# EAGLE design Hanover Flipdot Featherwing (EAGLE 9.6.2)
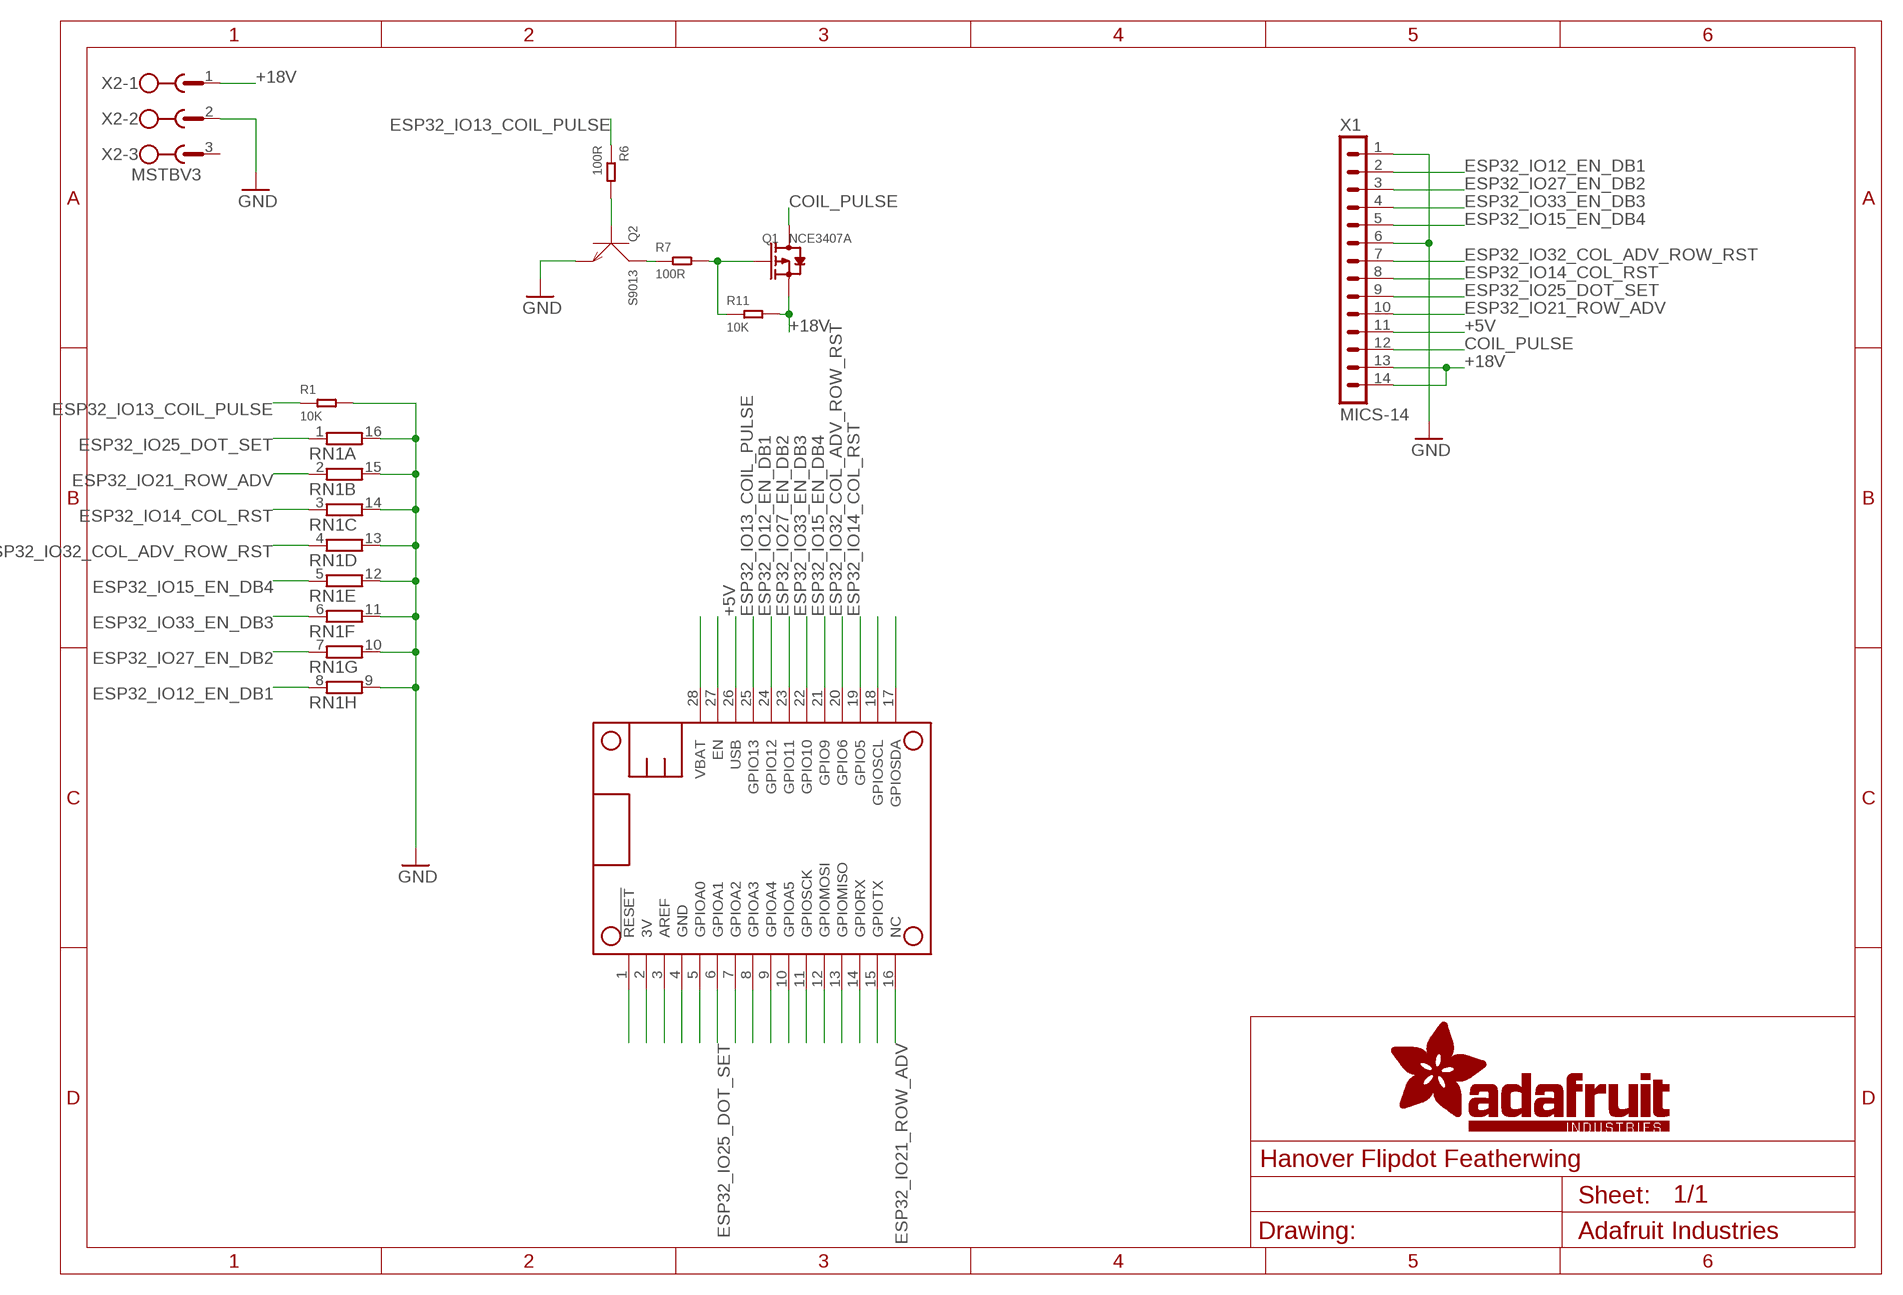
[diagram p0: schematic, sheet 1]

## Parts
MS1  FEATHERWING  [FEATHERWING]
Q1  NCE3407A  SMD-MOSFET-P-CH-VDC=30V-ID=4.3A-NCE3407A(SOT-23)  [SOT-23]
Q2  S9013  SMD-TRANSISTORS-NPN-25V-500MA-S9013(SOT-23)  [SOT-23]
R1  10K  SMD-RES-10K-1%-1/10W(0603)  [R0603]
R6  100R  SMD-RES-100R-5%-1/10W(0603)  [R0603]
R7  100R  SMD-RES-100R-5%-1/10W(0603)  [R0603]
R11  10K  SMD-RES-10K-1%-1/10W(0603)  [R0603]
RN1  8R-NEXB2HV  [EXB2HV]
X1  MICS-14  [MICS-14]
X2  MSTBV3  [MSTBV3]

## Nets
3V: MS1.2(3V)
+5V: MS1.26(USB) X1.11
+18V: Q1.2(S) R11.2 X1.13 X1.14 X2.1
AREF: MS1.3(AREF)
COIL_PULSE: Q1.3(D) X1.12
ESP32_IO12_EN_DB1: MS1.24(GPIO12) RN1.8 X1.2
ESP32_IO13_COIL_PULSE: MS1.25(GPIO13) R1.1 R6.1
ESP32_IO14_COL_RST: MS1.19(GPIO5) RN1.3 X1.8
ESP32_IO15_EN_DB4: MS1.21(GPIO9) RN1.5 X1.5
ESP32_IO21_ROW_ADV: MS1.16(NC) RN1.2 X1.10
ESP32_IO25_DOT_SET: MS1.6(GPIOA1) RN1.1 X1.9
ESP32_IO27_EN_DB2: MS1.23(GPIO11) RN1.7 X1.3
ESP32_IO32_COL_ADV_ROW_RST: MS1.20(GPIO6) RN1.4 X1.7
ESP32_IO33_EN_DB3: MS1.22(GPIO10) RN1.6 X1.4
GND: MS1.4(GND) Q2.2(E) R1.2 RN1.9 RN1.10 RN1.11 RN1.12 RN1.13 RN1.14 RN1.15 RN1.16 X1.1 X1.6 X2.2
N$1: MS1.27(EN)
N$3: Q2.1(B) R6.2
N$4: MS1.15(GPIOTX)
N$6: MS1.14(GPIORX)
N$7: MS1.13(GPIOMISO)
N$8: MS1.12(GPIOMOSI)
N$9: MS1.11(GPIOSCK)
N$10: MS1.10(GPIOA5)
N$11: MS1.9(GPIOA4)
N$12: MS1.8(GPIOA3)
N$13: MS1.7(GPIOA2)
N$15: MS1.5(GPIOA0)
N$16: Q1.1(G) R7.2 R11.1
N$17: Q2.3(C) R7.1
N$18: MS1.1(!RESET)
N$24: MS1.18(GPIOSCL)
N$25: MS1.17(GPIOSDA)
VBAT: MS1.28(VBAT)
Unconnected: X2.3

## Library data of the parts
MS1 = microbuilder:FEATHERWING
Q1 = OPL_Discrete_Semiconductor:SMD-MOSFET-P-CH-VDC=30V-ID=4.3A-NCE3407A(SOT-23): 305030010; MPN: NCE3407A
Q2 = OPL_Discrete_Semiconductor:SMD-TRANSISTORS-NPN-25V-500MA-S9013(SOT-23): 305010018; MPN: S9013
R1 R11 = OPL_Resistor:SMD-RES-10K-1%-1/10W(0603): 301011970; MPN: RC0603FR-0710KL
R6 R7 = OPL_Resistor:SMD-RES-100R-5%-1/10W(0603): 301011976; MPN: RC0603JR-07100RL
RN1 = resistor-dil:8R-N: DIL RESISTOR; OC_FARNELL: unknown; OC_NEWARK: unknown
X1 = con-lumberg:MICS-14: CONNECTOR; OC_FARNELL: unknown; OC_NEWARK: unknown
X2 = con-phoenix-508:MSTBV3: PHOENIX; MPN: MSTBV 2,5/3-GF-5.08; OC_FARNELL: 1792793; OC_NEWARK: 69R9846

## Board
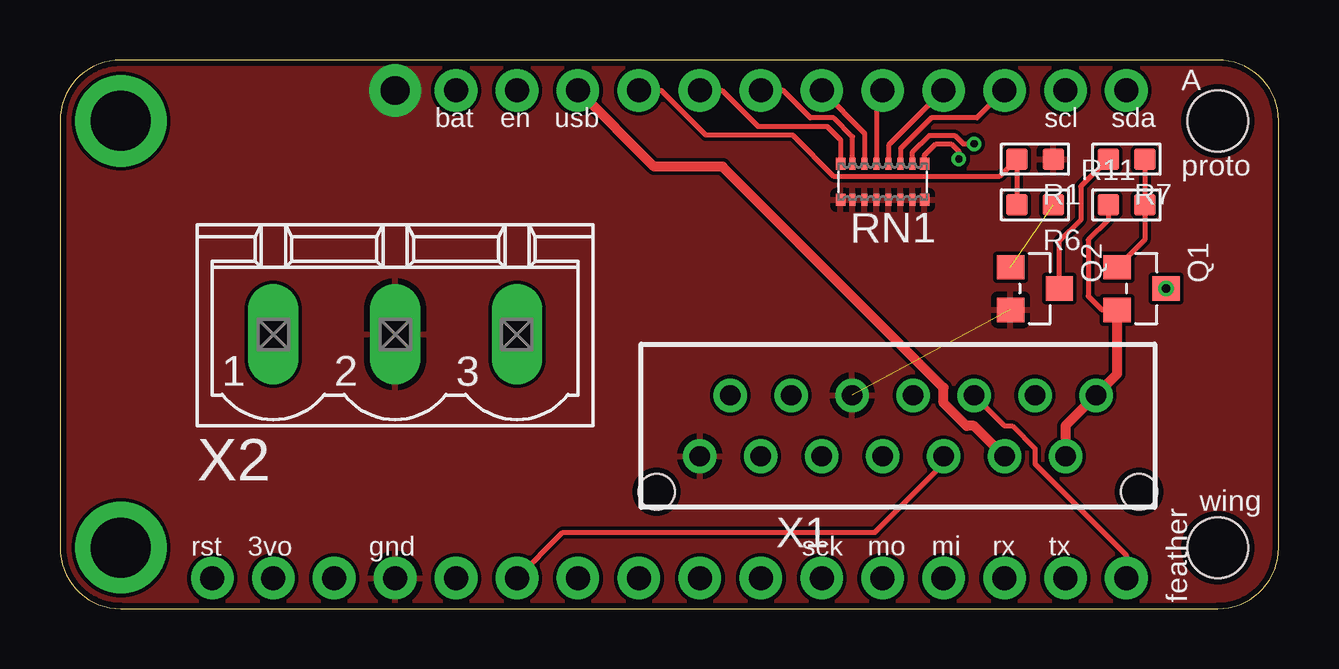
[diagram p1: board, top side]
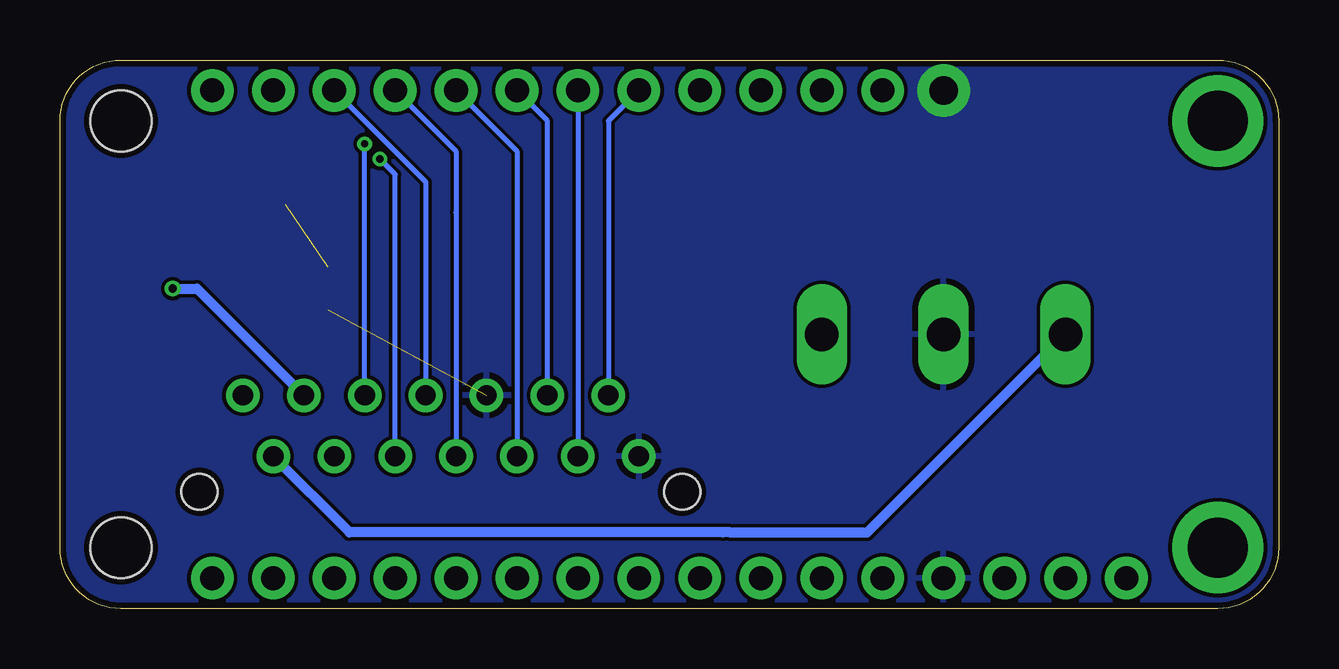
[diagram p2: board, bottom side, seen from below]

Size 50.8 x 22.86 mm. Coordinates in mm from the lower left corner, seen from the top.
Copper layers (1*16): Top 0.035mm / dielectric 1.5mm / Bottom 0.035mm
Design rules "SeeedStudio_2layer_DRU_no_angle_20140221": minimum track width 6mil, minimum drill 12mil, track to track 6mil, track to pad 6mil, pad to pad 6mil, via to via 6mil, smd to smd 0mil, copper to edge 10mil, drill to drill 10mil, minimum pad ring 10mil, minimum via ring 6mil, stop-mask expansion 2mil, vias tented up to drill 100mil, thermal gap 10mil

### Footprints (pad centres in the part's own frame; a part is rotated, then mirrored left to right if it is on the bottom)
FEATHERWING = drill 1 pad 1.778: 1 6.35,1.27; 2 8.89,1.27; 3 11.43,1.27; 4 13.97,1.27; 5 16.51,1.27; 6 19.05,1.27; 7 21.59,1.27; 8 24.13,1.27; 9 26.67,1.27; 10 29.21,1.27; 11 31.75,1.27; 12 34.29,1.27; 13 36.83,1.27; 14 39.37,1.27; 15 41.91,1.27; 16 44.45,1.27; 17 44.45,21.59; 18 41.91,21.59; 19 39.37,21.59; 20 36.83,21.59; 21 34.29,21.59; 22 31.75,21.59; 23 29.21,21.59; 24 26.67,21.59; 25 24.13,21.59; 26 21.59,21.59; 27 19.05,21.59; 28 16.51,21.59 | drill 2.5 pad 3.81: P$1 2.54,20.32; P$2 2.54,2.54 | hole 2.54: 48.26,20.32; 48.26,2.54
SOT-23 = smd 1.016 x 1.143: 1 -0.889,-1.016; 2 0.889,-1.016; 3 0,1.016
R0603 = smd 0.889 x 0.889: 1 0,0.762; 2 0,-0.762
EXB2HV = smd 0.38 x 0.5: 1 -1.75,-0.75; 8 1.75,-0.75; 9 1.75,0.75; 16 -1.75,0.75 | smd 0.25 x 0.5: 2 -1.25,-0.75; 3 -0.75,-0.75; 4 -0.25,-0.75; 5 0.25,-0.75; 6 0.75,-0.75; 7 1.25,-0.75; 10 1.25,0.75; 11 0.75,0.75; 12 0.25,0.75; 13 -0.25,0.75; 14 -0.75,0.75; 15 -1.25,0.75
MICS-14 = drill 0.85 pad 1.397: 1 -8.255,-1.27; 2 -6.985,1.27; 3 -5.715,-1.27; 4 -4.445,1.27; 5 -3.175,-1.27; 6 -1.905,1.27; 7 -0.635,-1.27; 8 0.635,1.27; 9 1.905,-1.27; 10 3.175,1.27; 11 4.445,-1.27; 12 5.715,1.27; 13 6.985,-1.27; 14 8.255,1.27 | hole 1.5: 10.055,-2.75; -10.055,-2.75
MSTBV3 = drill 1.397 long: 1 -5.08,0; 2 0,0; 3 5.08,0

### Placement (x,y rotation side)
MS1  0,0 0 top
Q1  45.09,13.34 270 top
Q2  40.64,13.34 270 top
R1  40.64,18.73 90 top
R6  40.64,16.83 90 top
R7  44.45,18.73 90 top
R11  44.45,16.83 270 top
RN1  34.29,17.78 180 top
X1  34.92,7.62 0 top
X2  13.97,11.43 0 top

### Tracks (layer width: path | path; a pad name or v marks a point on that pad's centre or on a via)
+5V
  Top 0.406: X1.11 38.1,7.62 37.78,7.62 36.83,8.57 36.83,9.21 27.62,18.41 24.77,18.41 MS1.26
+18V
  Top 0.203: 43.37,16.83 R11.2 43.69,16.19 42.86,15.37 42.86,13.02 43.43,12.45 Q1.2
  Top 0.406: X1.13 41.91,7.62 X1.14 44.07,9.78 Q1.2
  Bottom 0.406: X1.13 38.73,3.17 23.18,3.17 22.86,3.17 17.14,3.17 X2.1
COIL_PULSE  (via drill 0.35)
  Bottom 0.406: Q1.3 45.09,13.34 X1.12
  other vias: 46.1,13.34
ESP32_IO12_EN_DB1
  Top 0.203: MS1.24 27.59,21.59 29.09,20.09 31.98,20.09 32.54,19.53 RN1.8
  Bottom 0.203: MS1.24 27.94,20.32 X1.2
ESP32_IO13_COIL_PULSE
  Top 0.203: R6.1 R1.1 39.17,18.03 32.24,18.03 30.54,19.74 26.91,19.74 25.05,21.59 MS1.25
ESP32_IO14_COL_RST
  Top 0.203: RN1.3 35.04,19.16 36.32,20.45 38.23,20.45 MS1.19
  Bottom 0.203: MS1.19 35.56,17.78 X1.8
ESP32_IO15_EN_DB4
  Top 0.203: MS1.21 34.04,21.34 RN1.5
  Bottom 0.203: MS1.21 31.75,19.05 X1.5
ESP32_IO21_ROW_ADV  (via drill 0.3)
  Top 0.203: RN1.2 35.54,19.03 36.23,19.72 37.3,19.72 37.65,19.37 v38.1,19.37 | X1.10 39.37,7.62 39.69,7.62 40.64,6.67 40.64,6.03 44.45,2.22 MS1.16
  Bottom 0.203: X1.10 v38.1,19.37
ESP32_IO25_DOT_SET  (via drill 0.3)
  Top 0.203: MS1.6 20.95,3.17 33.97,3.17 36.83,6.03 X1.9 | RN1.1 36.04,18.89 36.51,19.37 37.15,19.37 37.47,19.05 v37.47,18.73
  Bottom 0.203: X1.9 36.83,18.1 v37.47,18.73
ESP32_IO27_EN_DB2
  Top 0.203: RN1.7 33.04,19.66 32.26,20.45 31.28,20.45 30.13,21.59 MS1.23
  Bottom 0.203: MS1.23 X1.3
ESP32_IO32_COL_ADV_ROW_RST
  Top 0.203: MS1.20 34.54,19.3 RN1.4
  Bottom 0.203: MS1.20 34.29,19.05 34.29,16.51 X1.7
ESP32_IO33_EN_DB3
  Top 0.203: MS1.22 33.54,19.8 RN1.6
  Bottom 0.203: X1.4 30.48,20.32 MS1.22
GND  (via drill 1.2 pad 2.18)  (1 unrouted)
  other vias: 13.97,21.59
  pour Top: 0,20.32 0,2.54 arc90 2.54,0 48.26,0 arc90 50.8,2.54 50.8,20.32 arc90 48.26,22.86 2.54,22.86 arc90
  pour Bottom: 0,20.32 0,2.54 arc90 2.54,0 48.26,0 arc90 50.8,2.54 50.8,20.32 arc90 48.26,22.86 2.54,22.86 arc90
N$3  (1 unrouted)
N$16
  Top 0.203: R7.2 R11.1 45.21,15.37 Q1.1
N$17
  Top 0.203: Q2.3 41.66,15.3 42.55,16.19 42.55,17.59 R7.1

### Text on the board
tPlace: A | bat | en | usb | scl | sda | proto | wing | rst | 3vo | gnd | sck | mo | mi | rx | tx | feather